# Altium schematic sheet BV100011_ControlPower.SchDoc
size A4
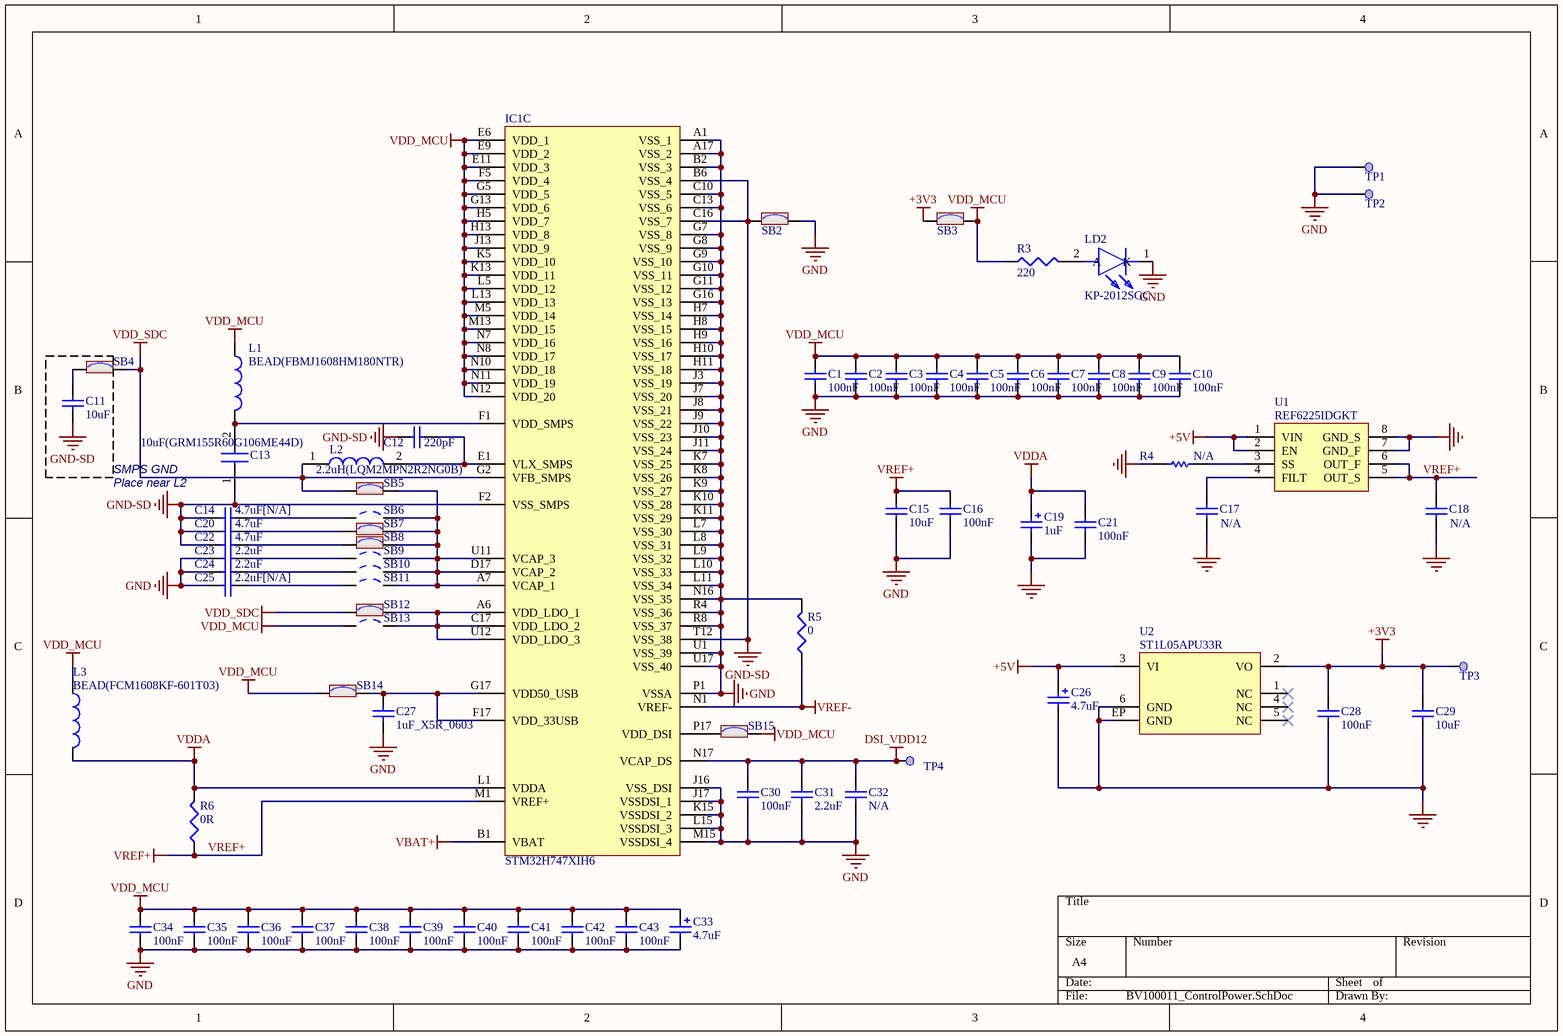
[diagram p0: BV100011_ControlPower.SchDoc]

## Parts
C1  100nF  [C0402]
C2  100nF  [C0402]
C3  100nF  [C0402]
C4  100nF  [C0402]
C5  100nF  [C0402]
C6  100nF  [C0402]
C7  100nF  [C0402]
C8  100nF  [C0402]
C9  100nF  [C0402]
C10  100nF  [C0402]
C11  10uF  [C0603]
C12  220pF  [C0402]
C13  10uF(GRM155R60G106ME44D)  [C0402]
C14  4.7uF[N/A]  [C0402]
C15  value 10uF  [C0805]  (hidden comment: Capacitor)
C16  100nF  [C0402]
C17  N/A  [C0603]
C18  N/A  [C1210]
C19  value 1uF  [CPOL_VISHAY_TANTAL-595D_1407_H220]  (hidden comment: Cap_POL_TANA)
C20  4.7uF  [C0402]
C21  value 100nF  [C0402]  (hidden comment: Capacitor)
C22  4.7uF  [C0402]
C23  2.2uF  [C0603]
C24  2.2uF  [C0603]
C25  2.2uF[N/A]  [C0603]
C26  value 4.7uF  [CPOL_VISHAY_TANTAL-595D_1407_H220]  (hidden comment: Cap_POL_TANA)
C27  1uF_X5R_0603  [C0603]
C28  value 100nF  [C0402]  (hidden comment: Capacitor)
C29  value 10uF  [C0805]  (hidden comment: Capacitor)
C30  100nF  [C0402]
C31  2.2uF  [C0603]
C32  N/A  [C1206]
C33  value 4.7uF  [CPOL_VISHAY_TANTAL-595D_1407_H220]  (hidden comment: Cap_POL_TANA)
C34  100nF  [C0402]
C35  100nF  [C0402]
C36  100nF  [C0402]
C37  100nF  [C0402]
C38  100nF  [C0402]
C39  100nF  [C0402]
C40  100nF  [C0402]
C41  100nF  [C0402]
C42  100nF  [C0402]
C43  100nF  [C0402]
IC1  STM32H747XIH6  [BGA265C80P17X17_1400X1400X110]  (part C of 3)
L1  BEAD(FBMJ1608HM180NTR)  [L0603]
L2  2.2uH(LQM2MPN2R2NG0B)  [IND_2016_MURATA_LQM2MPN2R2NG0]
L3  BEAD(FCM1608KF-601T03)  [L0603]
LD2  KP-2012SGC  [LEDC2012X110N]
R3  220  [R0603]
R4  N/A  [R0402]
R5  0  [R0603]
R6  0R  [R0603]
SB2  SB_ON  [SB_0603]  (value not drawn)
SB3  SB_ON  [SB_0603]  (value not drawn)
SB4  Solder Bridge ON  [SB_0603]  (value not drawn)
SB5  Solder Bridge ON  [SB_0603]  (value not drawn)
SB6  Solder Bridge OFF  [SB_0603]  (value not drawn)
SB7  Solder Bridge ON  [SB_0603]  (value not drawn)
SB8  Solder Bridge ON  [SB_0603]  (value not drawn)
SB9  Solder Bridge OFF  [SB_0603]  (value not drawn)
SB10  Solder Bridge OFF  [SB_0603]  (value not drawn)
SB11  Solder Bridge OFF  [SB_0603]  (value not drawn)
SB12  Solder Bridge ON  [SB_0603]  (value not drawn)
SB13  Solder Bridge OFF  [SB_0603]  (value not drawn)
SB14  Solder Bridge ON  [SB_0603]  (value not drawn)
SB15  Solder Bridge ON  [SB_0603]  (value not drawn)
TP1  Test Point  [TP_SMD_0-3MM]  (value not drawn)  (no BOM)
TP2  Test Point  [TP_SMD_0-3MM]  (value not drawn)  (no BOM)
TP3  Test Point  [TP_SMD_0-3MM]  (value not drawn)  (no BOM)
TP4  Test Point  [TP_SMD_0-3MM]  (value not drawn)  (no BOM)
U1  value REF6225IDGKT  [ICC_VSSOP8_DGK_S-PDSO-G8_3X3_P065]
U2  ST1L05APU33R  [ICC_DFN6-EPAD_3X3_P095]

## Nets
+3V3: C28.1 C29.2 SB3.1 TP3.1 U2.2(VO)
+5V: C26.1 U1.1(VIN) U1.2(EN) U2.3(VI)
DSI_VDD12: C30.2 C31.2 C32.2 IC1.N17(VCAP_DS) TP4.1
GND: C1.1 C2.1 C3.1 C4.1 C5.1 C6.1 C7.1 C8.1 C9.1 C10.1 C15.1 C16.1 C17.1 C18.1 C19.2 C21.1 C23.1 C24.1 C25.1 C26.2 C27.1 C28.2 C29.1 C30.1 C31.1 C32.1 C33.2 C34.1 C35.1 C36.1 C37.1 C38.1 C39.1 C40.1 C41.1 C42.1 C43.1 IC1.A1(VSS_1) IC1.A17(VSS_2) IC1.B2(VSS_3) IC1.C10(VSS_5) IC1.C13(VSS_6) IC1.G7(VSS_8) IC1.G8(VSS_9) IC1.G9(VSS_10) IC1.G10(VSS_11) IC1.G11(VSS_12) IC1.G16(VSS_13) IC1.H7(VSS_14) IC1.H8(VSS_15) IC1.H9(VSS_16) IC1.H10(VSS_17) IC1.H11(VSS_18) IC1.J3(VSS_19) IC1.J7(VSS_20) IC1.J8(VSS_21) IC1.J9(VSS_22) IC1.J10(VSS_23) IC1.J11(VSS_24) IC1.J16(VSS_DSI) IC1.J17(VSSDSI_1) IC1.K7(VSS_25) IC1.K8(VSS_26) IC1.K9(VSS_27) IC1.K10(VSS_28) IC1.K11(VSS_29) IC1.K15(VSSDSI_2) IC1.L7(VSS_30) IC1.L8(VSS_31) IC1.L9(VSS_32) IC1.L10(VSS_33) IC1.L11(VSS_34) IC1.L15(VSSDSI_3) IC1.M15(VSSDSI_4) IC1.N16(VSS_35) IC1.P1(VSSA) IC1.R4(VSS_36) IC1.R8(VSS_37) IC1.U1(VSS_39) IC1.U17(VSS_40) LD2.1(K) R4.1 R5.2 SB2.2 TP1.1 TP2.1 U1.7(GND_F) U1.8(GND_S) U2.6(GND) U2.EP(GND)
GND-SD: C11.1 C12.1 C13.1 C14.1 C20.1 C22.1 IC1.B6(VSS_4) IC1.C16(VSS_7) IC1.F2(VSS_SMPS) IC1.T12(VSS_38) SB2.1
VBAT+: IC1.B1(VBAT)
VDD_MCU: C1.2 C2.2 C3.2 C4.2 C5.2 C6.2 C7.2 C8.2 C9.2 C10.2 C33.1 C34.2 C35.2 C36.2 C37.2 C38.2 C39.2 C40.2 C41.2 C42.2 C43.2 IC1.E6(VDD_1) IC1.E9(VDD_2) IC1.E11(VDD_3) IC1.F5(VDD_4) IC1.G5(VDD_5) IC1.G13(VDD_6) IC1.H5(VDD_7) IC1.H13(VDD_8) IC1.J13(VDD_9) IC1.K5(VDD_10) IC1.K13(VDD_11) IC1.L5(VDD_12) IC1.L13(VDD_13) IC1.M5(VDD_14) IC1.M13(VDD_15) IC1.N7(VDD_16) IC1.N8(VDD_17) IC1.N10(VDD_18) IC1.N11(VDD_19) IC1.N12(VDD_20) L1.1 L3.1 R3.1 SB3.2 SB13.1 SB14.1 SB15.2
VDD_SDC: IC1.G2(VFB_SMPS) L2.1 SB4.2 SB5.1 SB12.1
VDDA: C19.1 C21.2 IC1.L1(VDDA) L3.2 R6.2
VREF+: C15.2 C16.2 C18.2 IC1.M1(VREF+) R6.1 U1.5(OUT_S) U1.6(OUT_F)
VREF-: IC1.N1(VREF-) R5.1
NetC11_2: C11.2 SB4.1
NetC12_2: C12.2 IC1.E1(VLX_SMPS) L2.2
NetC13_2: C13.2 IC1.F1(VDD_SMPS) L1.2
NetC14_2: C14.2 SB6.1
NetC17_2: C17.2 U1.4(FILT)
NetC20_2: C20.2 SB7.1
NetC22_2: C22.2 SB8.1
NetC23_2: C23.2 SB9.1
NetC24_2: C24.2 SB10.1
NetC25_2: C25.2 SB11.1
NetC27_2: C27.2 IC1.F17(VDD_33USB) IC1.G17(VDD50_USB) SB14.2
NetIC1_A6: IC1.A6(VDD_LDO_1) IC1.C17(VDD_LDO_2) IC1.U12(VDD_LDO_3) SB12.2 SB13.2
NetIC1_A7: IC1.A7(VCAP_1) IC1.D17(VCAP_2) IC1.U11(VCAP_3) SB5.2 SB6.2 SB7.2 SB8.2 SB9.2 SB10.2 SB11.2
NetIC1_P17: IC1.P17(VDD_DSI) SB15.1
NetLD2_2: LD2.2(A) R3.2
NetR4_2: R4.2 U1.3(SS)

Not connected (* = marked no-connect by the designer): U2 1(NC)* 4(NC)* 5(NC)*

## Notes on the sheet
- SMPS GND
- Place near L2

## Library data of the parts
C1-C12 C16 C20 C22 C30-C32 C34-C43 = Cap Semi: Capacitor (Semiconductor SIM Model); Published: 8-Jun-2000; LatestRevisionDate: 29-May-2009; LatestRevisionNote: IPC-7351 Footprint Added.; PackageReference: C1206; Publisher: Altium Limited; PackageDescription: Chip Capacitor
  C1-C10 C16 C30 C34-C43: Value: 100nF
  C11: Value: 10uF
  C12: Value: 220pF
  C20 C22: Value: 4.7uF
  C31: Value: 2.2uF
  C32: Value: N/A
C13 = GRM155R60G106ME44D: Capacitor; Manufacturer_Name: Murata Electronics; Datasheet Link: http://www.murata.com/~/media/webrenewal/support/library/catalog/products/capacitor/mlcc/c02e.pdf; Height: 0.55mm; Manufacturer_Part_Number: GRM155R60G106ME44D; Mouser Part Number: 81-GRM155R60G106ME4D; Mouser Price/Stock: https://www.mouser.com/Search/Refine.aspx?Keyword=81-GRM155R60G106ME4D; RS Part Number: 1726711P; RS Price/Stock: http://uk.rs-online.com/web/p/products/1726711P
C14 = Cap Semi: Capacitor (Semiconductor SIM Model); Value: 4.7uF; Published: 8-Jun-2000; LatestRevisionDate: 29-May-2009; LatestRevisionNote: IPC-7351 Footprint Added.; PackageReference: C1206; Publisher: Altium Limited; PackageDescription: Chip Capacitor
C15 C29 = MCD-00014: Capacitor, MLCC, 10uF, 25V, X5R, 10%, 0805, T=0,85mm; Manufacturer_Part_Number: CC0805KRX5R8BB106; Manufacturer: YAGEO; Provided_By: Subcon; Initial_Board_Reference: mb1274; Internal_Part_Number: MCD-00014; ECCN_US: n/a; ECCN_EU: n/a; ComponentLink1Description: Yageo_Capacitor_X5R-series.pdf; Status: Released; Part_Type: Capacitor; Package: C0805; ComponentLink1URL: http://tunmcdsvn.tun.st.com/Component_Datasheet_Library/Trunk/Capacitors/Yageo_Capacitor_X5R-series.pdf
C17 = MCD-00010: Capacitor, MLCC, 1uF, 16V, X5R, 10%, 0603, T=0,8mm; Manufacturer_Part_Number: CC0603KRX5R7BB105; Manufacturer: YAGEO; Provided_By: Subcon; Initial_Board_Reference: mb1274; Internal_Part_Number: MCD-00010; Value: 1uF; Status: Released; Part_Type: Capacitor; Package: C0603; ComponentLink1Description: Yageo_Capacitor_X5R-series.pdf; ComponentLink1URL: http://tunmcdsvn.tun.st.com/Component_Datasheet_Library/Trunk/Capacitors/Yageo_Capacitor_X5R-series.pdf; ECCN_US: n/a; ECCN_EU: n/a
C18 = MCD-00614: Capacitor, MLCC, 22uF, 16V, 1210, X7R, 20%, T=2,5mm, ESR 2mohm@410KHz; Manufacturer_Part_Number: GCM32ER71C226ME19; Manufacturer: MURATA; Provided_By: Subcon; Initial_Board_Reference: MB1331; Internal_Part_Number: MCD-00614; Value: 22uF; Status: Footprint available; Part_Type: Capacitor; Package: C1210; ComponentLink1Description: Murata_22uF_1210_GCM32ER71C226ME19.pdf; ComponentLink1URL: http://tunmcdsvn.tun.st.com/Component_Datasheet_Library/Trunk/Capacitors/Murata_Capacitor_GC_series
C19 = MCD-00594: Capacitor, Tantalum, 1uF, 35V, +/-10%, 595D case A; Manufacturer_Part_Number: 595D105X9035A2T; Manufacturer: VISHAY; Order_Code_RS: 117-404; Provided_By: Subcon; Initial_Board_Reference: MB1331; Revision: July-2002: Re-released for DXP Platform.; Internal_Part_Number: MCD-00594; Status: Footprint available; Part_Type: Capacitor; ComponentLink1Description: VISHAY_CAPACITOR_TANTALUM_595D.pdf; ComponentLink1URL: http://tunmcdsvn.tun.st.com/Component_Datasheet_Library/Trunk/Capacitors/VISHAY_CAPACITOR_TANTALUM_595D; Order_Code_Digikey: 595D105X9035A2T-ND; Order_Code_Farnell: 1166819
C21 C28 = MCD-00102: Capacitor, MLCC, 100nF, 16V, X7R, 10%, 0402, T=0,5mm; Manufacturer_Part_Number: CC0402KRX7R7BB104; Manufacturer: YAGEO; Provided_By: Subcon; Initial_Board_Reference: MB1262; Internal_Part_Number: MCD-00102; Status: Released; Part_Type: Capacitor; Package: C0402; ComponentLink1Description: Yageo_Capacitor_X7R-series.pdf; ComponentLink1URL: http://tunmcdsvn.tun.st.com/Component_Datasheet_Library/Trunk/Capacitors/Yageo_Multilayer_Capacitor_X7R_series_100pF_to_22uF; ECCN_US: n/a; ECCN_EU: n/a
C23 C24 = Cap: Capacitor; Value: 10nF; Published: 8-Jun-2000; Revision: July-2002: Re-released for DXP Platform.; Publisher: Altium Limited
C25 = Cap: Capacitor; Value: 10nF; Fitted: NO; Published: 8-Jun-2000; Revision: July-2002: Re-released for DXP Platform.; Publisher: Altium Limited
C26 C33 = MCD-00595: Capacitor, Tantalum, 4.7uF, 16V, +/-10%, 595D case A; Manufacturer_Part_Number: 595D475X9016A2T; Manufacturer: VISHAY; Order_Code_RS: 117-303; Provided_By: Subcon; Initial_Board_Reference: MB1331; Revision: July-2002: Re-released for DXP Platform.; Internal_Part_Number: MCD-00595; Status: Footprint available; Part_Type: Capacitor; ComponentLink1Description: VISHAY_CAPACITOR_TANTALUM_595D.pdf; ComponentLink1URL: http://tunmcdsvn.tun.st.com/Component_Datasheet_Library/Trunk/Capacitors/VISHAY_CAPACITOR_TANTALUM_595D; Order_Code_Digikey: 595D475X9016A2T-ND; Order_Code_Farnell: 1166805
C27 = Cap Semi: Capacitor (Semiconductor SIM Model); Value: 1uF; Published: 8-Jun-2000; LatestRevisionDate: 29-May-2009; LatestRevisionNote: IPC-7351 Footprint Added.; PackageReference: C1206; Publisher: Altium Limited; PackageDescription: Chip Capacitor
IC1 = STM32H747XIH6: Integrated Circuit; Manufacturer_Name: STMicroelectronics; Datasheet Link: https://www.st.com/en/microcontrollers-microprocessors/stm32h747xi.html; Height: 1.1mm; Manufacturer_Part_Number: STM32H747XIH6; Mouser Part Number: 511-STM32H747XIH6; Mouser Price/Stock: https://www.mouser.com/Search/Refine.aspx?Keyword=511-STM32H747XIH6
L1 L3 = Inductor: Value: 100uH; Published: 8-Jun-2000; Revision: July-2002: Re-released for DXP Platform.; Publisher: Altium Limited
L2 = LQM2MPN2R2NG0B: Inductor; Manufacturer_Name: Murata Electronics; Datasheet Link: https://psearch.en.murata.com/inductor/product/LQM2MPN2R2NG0%23.html; Height: 1mm; Manufacturer_Part_Number: LQM2MPN2R2NG0B; Mouser Part Number: N/A; Mouser Price/Stock: https://www.mouser.com/Search/Refine.aspx?Keyword=N%2FA
LD2 = KP-2012SGC: LED; Manufacturer_Name: Kingbright; Datasheet Link: http://my.rs-online.com/webdocs/032f/0900766b8032fa8b.pdf; Height: 1.1mm; Manufacturer_Part_Number: KP-2012SGC; Mouser Part Number: N/A; Mouser Price/Stock: https://www.mouser.com/Search/Refine.aspx?Keyword=N%2FA; RS Part Number: 4663807P; RS Price/Stock: http://uk.rs-online.com/web/p/products/4663807P
R3 R5 R6 = Res3: Resistor; Published: 8-Jun-2000; LatestRevisionDate: 29-May-2009; LatestRevisionNote: IPC-7351 Footprint Added.; PackageReference: J1-0603; Publisher: Altium Limited; PackageDescription: Chip Resistor
  R3: Value: 220
  R5: Value: 0
  R6: Value: 0R
R4 = MCD-00166: Resistor,120K,0402,1%,1/16W; Manufacturer_Part_Number: RC0402FR-07120KL; Manufacturer: YAGEO; Provided_By: Subcon; Initial_Board_Reference: MB1264; Internal_Part_Number: MCD-00166; Value: 120K; Status: Footprint available; Part_Type: Resistor; Package: R0402; ComponentLink1Description: Yageo_Resistor_RC0402-series.pdf; ComponentLink1URL: http://tunmcdsvn.tun.st.com/Component_Datasheet_Library/Trunk/Resistors/Yageo_Resistor_RC0402-series; ECCN_US: n/a; ECCN_EU: n/a
SB2 SB3 = MCD-00071: Solder Bridge ON; Part_Type: Mechanical; Manufacturer_Part_Number: RC0603JR-070RL; Manufacturer: YAGEO; Provided_By: SUBCO; Internal_Part_Number: MCD-00071; Status: Released; ComponentLink1Description: Datasheet; Package: SB0603; ComponentLink1URL: http://tunmcdsvn.tun.st.com/Component_Datasheet_Library/Trunk/Resistors/Yageo_Resistor_RC0603-series; ECCN_US: n/a; ECCN_EU: n/a
SB4 SB5 SB7 SB8 SB12 SB14 SB15 = SB_ON: Fitted: YES; Ordered by: Subcon; Revision: July-2002: Re-released for DXP Platform.; ECCN_US/EU: n/a
SB6 SB9-SB11 SB13 = SB_OFF: Fitted: NO; Ordered by: Subcon; Revision: July-2002: Re-released for DXP Platform.; ECCN_US/EU: n/a
TP1-TP4 = MCD-00630: Test Point 0.3mm; Part_Type: Mechanical; Initial_Board_Reference: MB1264; Internal_Part_Number: MCD-00630; Status: Released; ECCN_US: n/a; ECCN_EU: n/a; Provided_By: n/a
U1 = MCD-01138: IC VREF SERIES 2.5V 8VSSOP; Manufacturer: TI; Provided_By: Subcon; Initial_Board_Reference: MB1381; Internal_Part_Number: MCD-01138; Status: Footprint available; Part_Type: IC; Manufacturer_Part_Number: REF6225IDGKT; Package: VSSOP8; ComponentLink1Description: TI_REF_REF6225IDGKT; ComponentLink1URL: http://tunmcdsvn.tun.st.com/Component_Datasheet_Library/Trunk/IC/TI_REF_REF6225IDGKT/TI_REF_REF6225IDGKT.pdf; ECCN_US: N/A; ECCN_EU: N/A
U2 = MCD-01127: IC REG LDO 3.3V 1.3A 6DFN; Manufacturer: STMICROELECTRONICS; ECCN_US: EAR99; ECCN_EU: NEC; Provided_By: Subcon; Initial_Board_Reference: MB1381; Internal_Part_Number: MCD-01127; Value: ST1L05APU33R; Status: Footprint available; Part_Type: IC; Manufacturer_Part_Number: ST1L05APU33R; Package: DFN6; ComponentLink1Description: STM_LDO_ST1L05CPU33R.pdf; ComponentLink1URL: http://tunmcdsvn.tun.st.com/Component_Datasheet_Library/Trunk/IC/STM_LDO_ST1L05CPU33R/STM_LDO_ST1L05CPU33R.pdf